# EAGLE schematic SWARMESH (EAGLE 9.4.2)
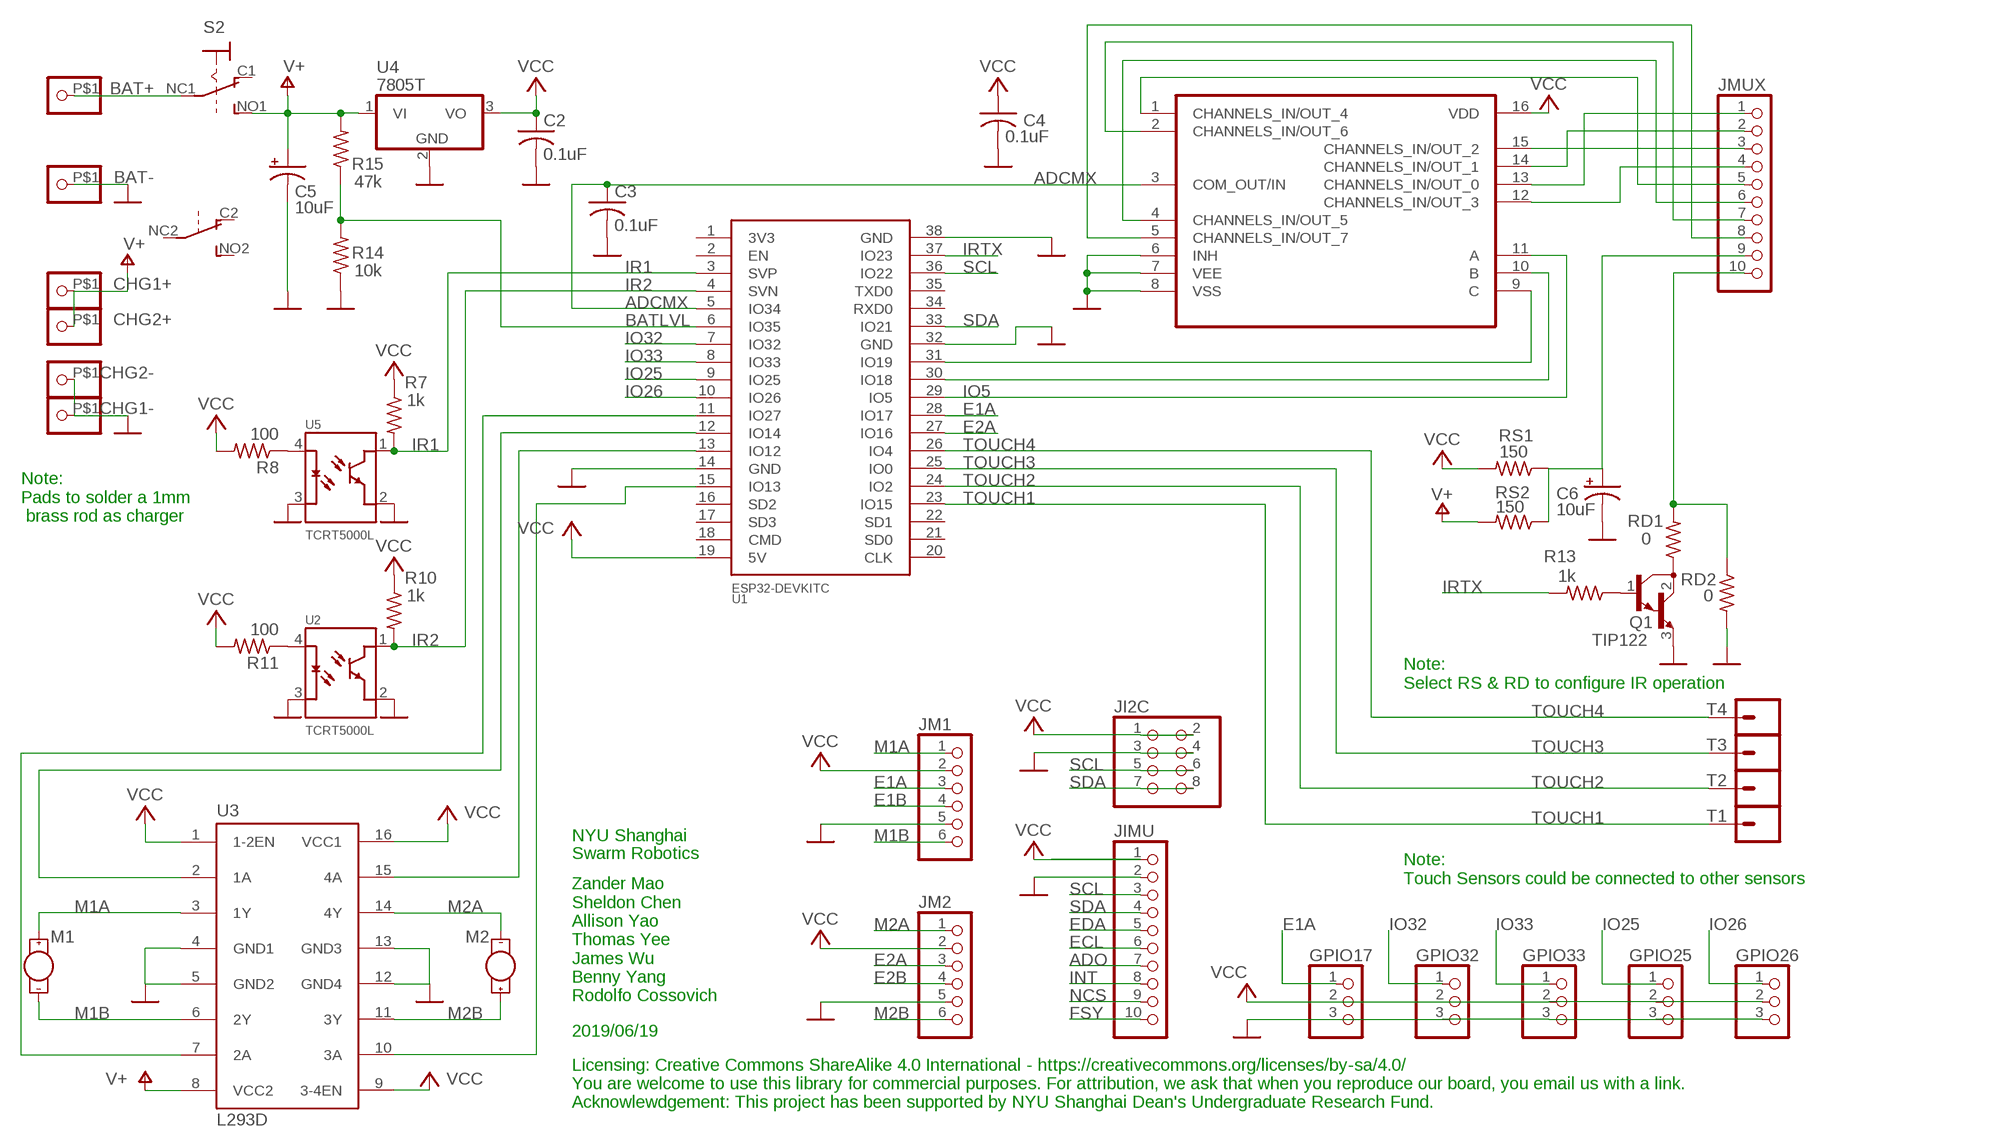
[diagram p0: schematic, sheet 1]

## Parts
BAT+  PINHD-1X1-BIGPOGO  [1X1-BIGPOGO]
BAT-  PINHD-1X1-BIGPOGO  [1X1-BIGPOGO]
C2  0.1uF  C-US050-024X044  [C050-024X044]
C3  0.1uF  C-US050-024X044  [C050-024X044]
C4  0.1uF  C-US050-024X044  [C050-024X044]
C5  10uF  CPOL-USE2.5-7  [E2,5-7]
C6  10uF  CPOL-USE2.5-7  [E2,5-7]
CHG1+  PINHD-1X1-BIGPOGO  [1X1-BIGPOGO]
CHG1-  PINHD-1X1-BIGPOGO  [1X1-BIGPOGO]
CHG2+  PINHD-1X1-BIGPOGO  [1X1-BIGPOGO]
CHG2-  PINHD-1X1-BIGPOGO  [1X1-BIGPOGO]
GPIO17  PINHD-1X3  [1X03]
GPIO25  PINHD-1X3  [1X03]
GPIO26  PINHD-1X3  [1X03]
GPIO32  PINHD-1X3  [1X03]
GPIO33  PINHD-1X3  [1X03]
JI2C  PINHD-2X4  [2X04]
JIMU  PINHD-1X10  [1X10-BIG]
JM1  PINHD-1X6  [1X06]
JM2  PINHD-1X6  [1X06]
JMUX  PINHD-1X10  [1X10-BIG]
M1  MOTOR10MM  [VIBE-MOTOR-10MM]
M2  MOTOR10MM  [VIBE-MOTOR-10MM]
Q1  TIP122  [TO220]
R7  1k  R-US_0207/12  [0207/12]
R8  100  R-US_0207/12  [0207/12]
R10  1k  R-US_0207/12  [0207/12]
R11  100  R-US_0207/12  [0207/12]
R13  1k  R-US_0207/12  [0207/12]
R14  10k  R-US_0207/12  [0207/12]
R15  47k  R-US_0207/12  [0207/12]
RD1  0  R-US_0207/12  [0207/12]
RD2  0  R-US_0207/12  [0207/12]
RS1  150  R-US_0207/12  [0207/12]
RS2  150  R-US_0207/12  [0207/12]
S2  SWITCH_320-938  [PS22F03]
T1  CONN_01SPRING-CONN  [SPRING-CONNECTOR]
T2  CONN_01SPRING-CONN  [SPRING-CONNECTOR]
T3  CONN_01SPRING-CONN  [SPRING-CONNECTOR]
T4  CONN_01SPRING-CONN  [SPRING-CONNECTOR]
U1  ESP32DEVKITC  [ESP32-DEVKITC]
U2  TCRT5000L  [XDCR_TCRT5000L]
U3  L293D  [DIL16]
U4  7805T  [TO220H]
U5  TCRT5000L  [XDCR_TCRT5000L]
U6  CD4051BEE4  [CD4051BEE4DIP]

## Nets
ADCMX: C3.1 U1.5(IO34) U6.3(COM_OUT/IN)
ADO: JIMU.7
BATLVL: R14.2 R15.1 U1.6(IO35)
E1A: GPIO17.1 JM1.3 U1.28(IO17)
E1B: JM1.4
E2A: JM2.3 U1.27(IO16)
E2B: JM2.4
ECL: JIMU.6
EDA: JIMU.5
FSY: JIMU.10
GND: BAT-.P$1 C2.2 C3.2 C4.2 C5.- C6.- CHG1-.P$1 CHG2-.P$1 GPIO17.3 GPIO25.3 GPIO26.3 GPIO32.3 GPIO33.3 JI2C.3 JI2C.4 JIMU.2 JM1.5 JM2.5 Q1.3(E) R14.1 RD2.2 U1.14(GND) U1.32(GND) U1.38(GND) U2.2(E) U2.3(C) U3.4(GND1) U3.5(GND2) U3.12(GND4) U3.13(GND3) U4.2(GND) U5.2(E) U5.3(C)
INT: JIMU.8
IO5: U1.11(IO27) U1.12(IO14) U1.13(IO12) U1.15(IO13) U1.29(IO5) U3.2(1A) U3.7(2A) U3.10(3A) U3.15(4A) U6.11(A)
IO25: GPIO25.1 U1.9(IO25)
IO26: GPIO26.1 U1.10(IO26)
IO32: GPIO32.1 U1.7(IO32)
IO33: GPIO33.1 U1.8(IO33)
IR1: R7.2 U1.3(SVP) U5.1(CO)
IR2: R10.2 U1.4(SVN) U2.1(CO)
IRTX: R13.2 U1.37(IO23)
M1A: JM1.1 M1.+ U3.3(1Y)
M1B: JM1.6 M1.- U3.6(2Y)
M2A: JM2.1 M2.- U3.14(4Y)
M2B: JM2.6 M2.+ U3.11(3Y)
N$1: Q1.1(B) R13.1
N$2: JMUX.5 U6.1(CHANNELS_IN/OUT_4)
N$3: JMUX.1 U6.13(CHANNELS_IN/OUT_0)
N$4: JMUX.2 U6.14(CHANNELS_IN/OUT_1)
N$5: JMUX.6 U6.4(CHANNELS_IN/OUT_5)
N$6: JMUX.4 U6.12(CHANNELS_IN/OUT_3)
N$7: U1.30(IO18) U6.10(B)
N$8: U1.31(IO19) U6.9(C)
N$9: R11.1 U2.4(A)
N$10: R8.1 U5.4(A)
N$11: JMUX.3 U6.15(CHANNELS_IN/OUT_2)
N$12: U6.6(INH) U6.7(VEE) U6.8(VSS) ; supply symbol labelled GND
N$13: JMUX.7 U6.2(CHANNELS_IN/OUT_6)
N$14: JMUX.8 U6.5(CHANNELS_IN/OUT_7)
N$15: C6.+ JMUX.9 RS1.1 RS2.1
N$17: JMUX.10 RD1.2 RD2.1
N$21: BAT+.P$1 S2.NC1(1:P)
N$37: Q1.2(C) RD1.1
NCS: JIMU.9
SCL: JI2C.5 JI2C.6 JIMU.3 U1.36(IO22)
SDA: JI2C.7 JI2C.8 JIMU.4 U1.33(IO21)
TOUCH1: T1.P$2 U1.23(IO15)
TOUCH2: T2.P$2 U1.24(IO2)
TOUCH3: T3.P$2 U1.25(IO0)
TOUCH4: T4.P$2 U1.26(IO4)
V+: C5.+ CHG1+.P$1 CHG2+.P$1 R15.2 RS2.2 S2.NO1(1:S) U3.8(VCC2) U4.1(VI)
VCC: C2.1 C4.1 GPIO17.2 GPIO25.2 GPIO26.2 GPIO32.2 GPIO33.2 JI2C.1 JI2C.2 JIMU.1 JM1.2 JM2.2 R7.1 R8.2 R10.1 R11.2 RS1.2 U1.19(5V) U3.1(1-2EN) U3.9(3-4EN) U3.16(VCC1) U4.3(VO) U6.16(VDD)
Unconnected: S2.C1(1:O) S2.C2(B:O) S2.NC2(B:P) S2.NO2(B:S) U1.1(3V3) U1.2(EN) U1.16(SD2) U1.17(SD3) U1.18(CMD) U1.20(CLK) U1.21(SD0) U1.22(SD1) U1.34(RXD0) U1.35(TXD0)

## Notes on the sheet
- Note:
  Pads to solder a 1mm
   brass rod as charger
- Note:
  Select RS & RD to configure IR operation
- NYU Shanghai
- Swarm Robotics
- Note:
  Touch Sensors could be connected to other sensors
- Zander Mao
  Sheldon Chen
  Allison Yao
  Thomas Yee
  James Wu
  Benny Yang
  Rodolfo Cossovich
- 2019/06/19
- Licensing: Creative Commons ShareAlike 4.0 International - https://creativecommons.org/licenses/by-sa/4.0/ 
  You are welcome to use this library for commercial purposes. For attribution, we ask that when you reproduce our board, you email us with a link.
  Acknowlewdgement: This project has been supported by NYU Shanghai Dean's Undergraduate Research Fund.

## Library data of the parts
BAT+ BAT- CHG1+ CHG1- CHG2+ CHG2- = adafruit:PINHD-1X1: Pin header 1x1 for 0.1" spacing With round pins
C2-C4 = adafruit:C-US: CAPACITOR, American symbol
C5 C6 = adafruit:CPOL-US: POLARIZED CAPACITOR, American symbol
GPIO17 GPIO25 GPIO26 GPIO32 GPIO33 = adafruit:PINHD-1X3: PIN HEADER
JI2C = adafruit:PINHD-2X4: PIN HEADER
JIMU JMUX = adafruit:PINHD-1X10: Pin header 1x10 0.1" spacing With round pins
JM1 JM2 = adafruit:PINHD-1X6: PIN HEADER
M1 M2 = SparkFun-Electromechanical:MOTOR: Vibration Motor- ROB-08449 Physical dimension and wire connections for this powerful vibration motor. Motor has a self adhesive backing.
Q1 = transistor-npn:TIP122*: NPN Darlington Transistor
R7 R8 R10 R11 R13-R15 RD1 RD2 RS1 RS2 = adafruit:R-US_: RESISTOR, American symbol
S2 = ArduinoNano LearningBot 4-21-18:SWITCH_320-938: TOGGLE SWITCH distributor RS Components
T1-T4 = SparkFun-Connectors:CONN_01: Single connection point. Often used as Generic Header-pin footprint for 0.1 inch spaced/style header connections On any of the 0.1 inch spaced packages, you can populate with these: Break Away Headers - Straight <https://www.sparkfun.com/products/116> (PRT-00116) Break Away Male Headers - Right Angle <https://www.sparkfun.com/products/553> (PRT-00553) Female Headers <https://www.sparkfun.com/products/115> (PRT-00115) Break Away Headers - Machine Pin <https://www.sparkfun.com/products/117> (PRT-00117) Break Away Female Headers - Swiss Machine Pin <https://www.sparkfun.com/products/743> (PRT-00743) This device is also useful as a general connection point to wire up your design to another part of your project. Our various solder wires solder well into these plated through hole pads. Hook-Up Wire - Assortment (Stranded, 22 AWG) <https://www.sparkfun.com/products/11375> (PRT-11375) Hook-Up Wire - Assortment (Solid Core, 22 AWG) <https://www.sparkfun.com/products/11367> (PRT-11367) View the entire wire category on our website here <https://www.sparkfun.com/categories/141> Special notes: SMTSO-256-ET is a "flush mount" nut for a 4-40 screw. We mostly use this on specialty testbeds; it is a nice way to connect hardware to your PCB at an adjustable hieght. Also note, the SNAP packages are for using a snappable style connector. We sell a baggie of snaps and they are also used on two LilyPad designs: Snap Assortment - 30 pack (male and female) <https://www.sparkfun.com/products/11347> (DEV-11347) LilyPad Arduino SimpleSnap <https://www.sparkfun.com/products/10941> (DEV-10941) LilyPad SimpleSnap Protoboard <https://www.sparkfun.com/products/10940> (DEV-10940); SF_ID: PRT-11822
U1 = ESP32-DEVKITC (1):ESP32DEVKITC
U2 U5 = TCRT5000L:TCRT5000L: TCRT5000 Series 940 nm 100 mA 60 mA Transistor Output Reflective Optical Sensor; AVAILABILITY: Unavailable; DESCRIPTION: TCRT5000 Series 940 nm 100 mA 60 mA Transistor Output Reflective Optical Sensor; MF: Vishay Semiconductor; MP: TCRT5000L; PACKAGE: PCB Mount Vishay; PRICE: None
U3 = st-microelectronics:L293D: PUSH-PULL 4 CHANNEL DRIVER; MPN: L293D; OC_FARNELL: 9589619; OC_NEWARK: 56P8249
U4 = adafruit:78*: Positive VOLTAGE REGULATOR Added bigger pads to the TO-92 package
U6 = CD4051BEE4:CD4051BEE4: Multiplexer 8pin ADC/DAC